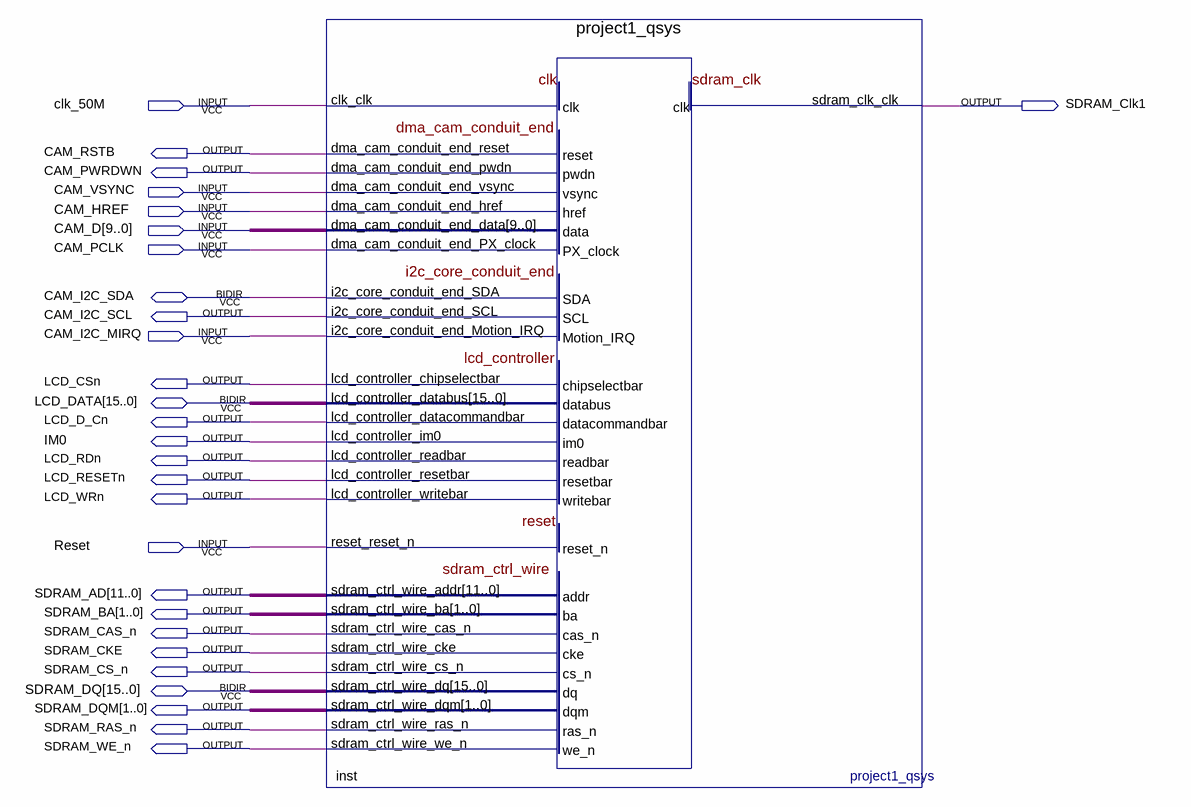
[diagram p0: schematic sheet]
// Quartus schematic project1_block.bdf as structural Verilog: 1 symbols, 28 pins
module project1_block (
  input  clk_50M,
  input  CAM_VSYNC,
  input  CAM_HREF,
  input  [9:0] CAM_D,
  input  CAM_PCLK,
  input  CAM_I2C_MIRQ,
  input  Reset,
  inout  CAM_I2C_SDA,
  inout  [15:0] LCD_DATA,
  inout  [15:0] SDRAM_DQ,
  output SDRAM_Clk1,
  output CAM_RSTB,
  output CAM_PWRDWN,
  output CAM_I2C_SCL,
  output LCD_CSn,
  output LCD_D_Cn,
  output IM0,
  output LCD_RDn,
  output LCD_RESETn,
  output LCD_WRn,
  output [11:0] SDRAM_AD,
  output [1:0] SDRAM_BA,
  output SDRAM_CAS_n,
  output SDRAM_CKE,
  output SDRAM_CS_n,
  output [1:0] SDRAM_DQM,
  output SDRAM_RAS_n,
  output SDRAM_WE_n
);

  project1_qsys inst (
    .clk_clk(clk_50M), .dma_cam_conduit_end_vsync(CAM_VSYNC), .dma_cam_conduit_end_href(CAM_HREF),
    .dma_cam_conduit_end_data(CAM_D), .dma_cam_conduit_end_PX_clock(CAM_PCLK),
    .i2c_core_conduit_end_Motion_IRQ(CAM_I2C_MIRQ), .reset_reset_n(Reset),
    .dma_cam_conduit_end_reset(CAM_RSTB), .dma_cam_conduit_end_pwdn(CAM_PWRDWN),
    .i2c_core_conduit_end_SCL(CAM_I2C_SCL), .lcd_controller_chipselectbar(LCD_CSn),
    .lcd_controller_datacommandbar(LCD_D_Cn), .lcd_controller_im0(IM0), .lcd_controller_readbar(LCD_RDn),
    .lcd_controller_resetbar(LCD_RESETn), .lcd_controller_writebar(LCD_WRn), .sdram_clk_clk(SDRAM_Clk1),
    .sdram_ctrl_wire_addr(SDRAM_AD), .sdram_ctrl_wire_ba(SDRAM_BA), .sdram_ctrl_wire_cas_n(SDRAM_CAS_n),
    .sdram_ctrl_wire_cke(SDRAM_CKE), .sdram_ctrl_wire_cs_n(SDRAM_CS_n), .sdram_ctrl_wire_dqm(SDRAM_DQM),
    .sdram_ctrl_wire_ras_n(SDRAM_RAS_n), .sdram_ctrl_wire_we_n(SDRAM_WE_n),
    .i2c_core_conduit_end_SDA(CAM_I2C_SDA), .lcd_controller_databus(LCD_DATA), .sdram_ctrl_wire_dq(SDRAM_DQ));
endmodule
